# Altium project Design III.PrjPcb
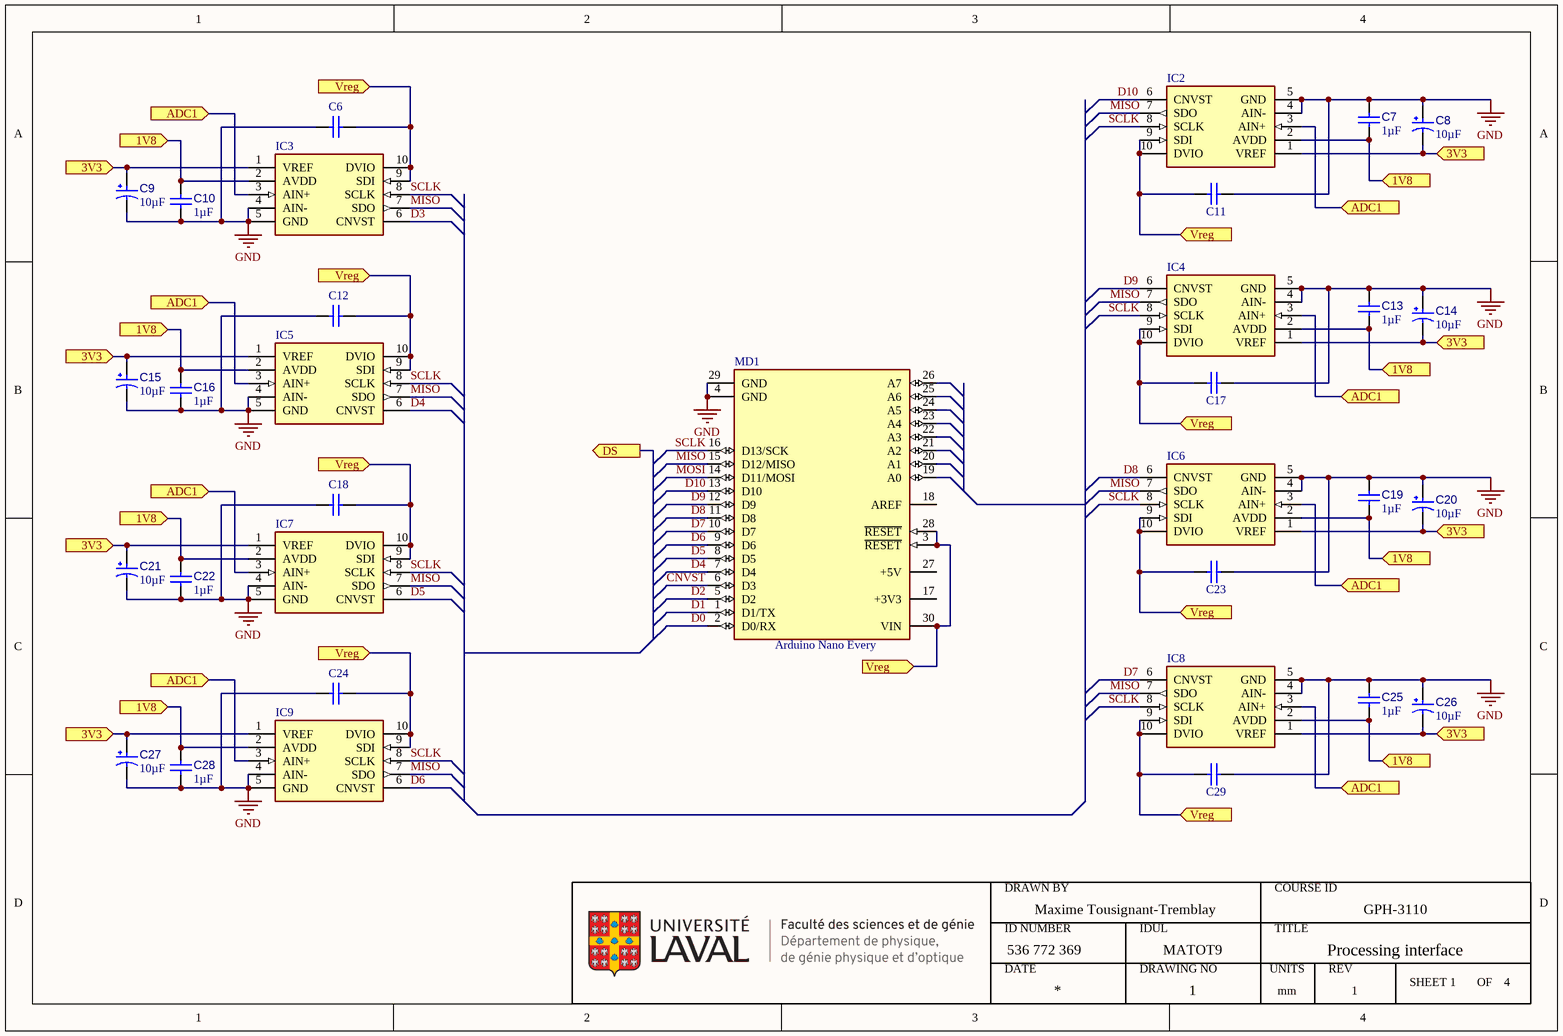
[diagram p0: Processing interface.SchDoc]
Author: =Author; CourseID: GPH-3110; DrawnBy: Maxime Tousignant-Tremblay; ID Number: 536 772 369; IDUL: MATOT9; Organization: =Organization; Revision: =Revision; SheetNumber: =SheetNumber; SheetTotal: =SheetTotal; Title: =Title; Units: mm
4 sheets, 127 parts. Net scope: flat (ports and power ports of the same name join across sheets).
Board file: PCB.PcbDoc
Sheets:
  Processing interface.SchDoc
  Thermistors.SchDoc
  Power Supply Unit.SchDoc
  Weatstone bridge.SchDoc

## Sheet Processing interface.SchDoc: Processing interface
size A4; Author: Maxime Tousignant-Tremblay; Revision: 1; SheetNumber: 1; SheetTotal: 4

### Parts
*4  ULaval FSG-DPGPO  (value not drawn)
C6  0402YC104KAT2A  [CAPC1005X56X25ML10T15]  (value not drawn)
C7  value 1µF  [CAPC0603(1608)100_L]  (hidden comment: Capacitor 1µF +/-0.1% 25V 0603)
C8  value 10µF  [CAPMP3217X18-T_V]  (hidden comment: TAJA106K016RNJ)
C9  value 10µF  [CAPMP3217X18-T_V]  (hidden comment: TAJA106K016RNJ)
C10  value 1µF  [CAPC0603(1608)100_L]  (hidden comment: Capacitor 1µF +/-0.1% 25V 0603)
C11  0402YC104KAT2A  [CAPC1005X56X25ML10T15]  (value not drawn)
C12  0402YC104KAT2A  [CAPC1005X56X25ML10T15]  (value not drawn)
C13  value 1µF  [CAPC0603(1608)100_L]  (hidden comment: Capacitor 1µF +/-0.1% 25V 0603)
C14  value 10µF  [CAPMP3217X18-T_V]  (hidden comment: TAJA106K016RNJ)
C15  value 10µF  [CAPMP3217X18-T_V]  (hidden comment: TAJA106K016RNJ)
C16  value 1µF  [CAPC0603(1608)100_L]  (hidden comment: Capacitor 1µF +/-0.1% 25V 0603)
C17  0402YC104KAT2A  [CAPC1005X56X25ML10T15]  (value not drawn)
C18  0402YC104KAT2A  [CAPC1005X56X25ML10T15]  (value not drawn)
C19  value 1µF  [CAPC0603(1608)100_L]  (hidden comment: Capacitor 1µF +/-0.1% 25V 0603)
C20  value 10µF  [CAPMP3217X18-T_V]  (hidden comment: TAJA106K016RNJ)
C21  value 10µF  [CAPMP3217X18-T_V]  (hidden comment: TAJA106K016RNJ)
C22  value 1µF  [CAPC0603(1608)100_L]  (hidden comment: Capacitor 1µF +/-0.1% 25V 0603)
C23  0402YC104KAT2A  [CAPC1005X56X25ML10T15]  (value not drawn)
C24  0402YC104KAT2A  [CAPC1005X56X25ML10T15]  (value not drawn)
C25  value 1µF  [CAPC0603(1608)100_L]  (hidden comment: Capacitor 1µF +/-0.1% 25V 0603)
C26  value 10µF  [CAPMP3217X18-T_V]  (hidden comment: TAJA106K016RNJ)
C27  value 10µF  [CAPMP3217X18-T_V]  (hidden comment: TAJA106K016RNJ)
C28  value 1µF  [CAPC0603(1608)100_L]  (hidden comment: Capacitor 1µF +/-0.1% 25V 0603)
C29  0402YC104KAT2A  [CAPC1005X56X25ML10T15]  (value not drawn)
IC2  MCP33141-10-E/MS  [New footprint 1]  (value not drawn)
IC3  MCP33141-10-E/MS  [New footprint 1]  (value not drawn)
IC4  MCP33141-10-E/MS  [New footprint 1]  (value not drawn)
IC5  MCP33141-10-E/MS  [New footprint 1]  (value not drawn)
IC6  MCP33141-10-E/MS  [New footprint 1]  (value not drawn)
IC7  MCP33141-10-E/MS  [New footprint 1]  (value not drawn)
IC8  MCP33141-10-E/MS  [New footprint 1]  (value not drawn)
IC9  MCP33141-10-E/MS  [New footprint 1]  (value not drawn)
MD1  Arduino Nano Every  [FP-A000005-MFG]

### Ports
1V8 (in, see Power Supply Unit[4C], Processing interface[1A], Processing interface[1B], Processing interface[1C], Processing interface[4A], Processing interface[4B], Processing interface[4C]), 1V8 (in, see Power Supply Unit[4C], Processing interface[1A], Processing interface[1B], Processing interface[1C], Processing interface[4A], Processing interface[4C]), 1V8 (in, see Power Supply Unit[4C], Processing interface[1A], Processing interface[1B], Processing interface[1C], Processing interface[4B], Processing interface[4C]), 1V8 (in, see Power Supply Unit[4C], Processing interface[1A], Processing interface[1C], Processing interface[4A], Processing interface[4B], Processing interface[4C]), 1V8 (in, see Power Supply Unit[4C], Processing interface[1B], Processing interface[1C], Processing interface[4A], Processing interface[4B], Processing interface[4C]), 3V3 (in, see Power Supply Unit[4B], Processing interface[1A], Processing interface[1B], Processing interface[1C], Processing interface[4A], Processing interface[4B], Processing interface[4C], Weatstone bridge[2B]), 3V3 (in, see Power Supply Unit[4B], Processing interface[1A], Processing interface[1B], Processing interface[1C], Processing interface[4A], Processing interface[4C], Weatstone bridge[2B]), 3V3 (in, see Power Supply Unit[4B], Processing interface[1A], Processing interface[1B], Processing interface[1C], Processing interface[4B], Processing interface[4C], Weatstone bridge[2B]), 3V3 (in, see Power Supply Unit[4B], Processing interface[1A], Processing interface[1C], Processing interface[4A], Processing interface[4B], Processing interface[4C], Weatstone bridge[2B]), 3V3 (in, see Power Supply Unit[4B], Processing interface[1B], Processing interface[1C], Processing interface[4A], Processing interface[4B], Processing interface[4C], Weatstone bridge[2B]), ADC1 (in, see Processing interface[1A], Processing interface[1B], Processing interface[1C], Processing interface[4A], Processing interface[4B], Processing interface[4C], Processing interface[4D], Weatstone bridge[4B]), ADC1 (in, see Processing interface[1A], Processing interface[1B], Processing interface[1C], Processing interface[4A], Processing interface[4B], Processing interface[4C], Weatstone bridge[4B]), ADC1 (in, see Processing interface[1A], Processing interface[1B], Processing interface[1C], Processing interface[4A], Processing interface[4B], Processing interface[4D], Weatstone bridge[4B]), ADC1 (in, see Processing interface[1A], Processing interface[1B], Processing interface[1C], Processing interface[4A], Processing interface[4C], Processing interface[4D], Weatstone bridge[4B]), ADC1 (in, see Processing interface[1A], Processing interface[1B], Processing interface[1C], Processing interface[4B], Processing interface[4C], Processing interface[4D], Weatstone bridge[4B]), ADC1 (in, see Processing interface[1A], Processing interface[1B], Processing interface[4A], Processing interface[4B], Processing interface[4C], Processing interface[4D], Weatstone bridge[4B]), ADC1 (in, see Processing interface[1B], Processing interface[1C], Processing interface[4A], Processing interface[4B], Processing interface[4C], Processing interface[4D], Weatstone bridge[4B]), DS (out, see Weatstone bridge[2B]), Vreg (in, see Power Supply Unit[3B], Processing interface[1A], Processing interface[1B], Processing interface[1C], Processing interface[3C], Processing interface[4A], Processing interface[4B], Processing interface[4C], Processing interface[4D], Weatstone bridge[2B], Weatstone bridge[2C], Weatstone bridge[3B]), Vreg (in, see Power Supply Unit[3B], Processing interface[1A], Processing interface[1B], Processing interface[1C], Processing interface[3C], Processing interface[4A], Processing interface[4B], Processing interface[4C], Weatstone bridge[2B], Weatstone bridge[2C], Weatstone bridge[3B]), Vreg (in, see Power Supply Unit[3B], Processing interface[1A], Processing interface[1B], Processing interface[1C], Processing interface[3C], Processing interface[4A], Processing interface[4B], Processing interface[4D], Weatstone bridge[2B], Weatstone bridge[2C], Weatstone bridge[3B]), Vreg (in, see Power Supply Unit[3B], Processing interface[1A], Processing interface[1B], Processing interface[1C], Processing interface[3C], Processing interface[4A], Processing interface[4C], Processing interface[4D], Weatstone bridge[2B], Weatstone bridge[2C], Weatstone bridge[3B]), Vreg (in, see Power Supply Unit[3B], Processing interface[1A], Processing interface[1B], Processing interface[1C], Processing interface[3C], Processing interface[4B], Processing interface[4C], Processing interface[4D], Weatstone bridge[2B], Weatstone bridge[2C], Weatstone bridge[3B]), Vreg (in, see Power Supply Unit[3B], Processing interface[1A], Processing interface[1B], Processing interface[1C], Processing interface[4A], Processing interface[4B], Processing interface[4C], Processing interface[4D], Weatstone bridge[2B], Weatstone bridge[2C], Weatstone bridge[3B]), Vreg (in, see Power Supply Unit[3B], Processing interface[1A], Processing interface[1B], Processing interface[3C], Processing interface[4A], Processing interface[4B], Processing interface[4C], Processing interface[4D], Weatstone bridge[2B], Weatstone bridge[2C], Weatstone bridge[3B]), Vreg (in, see Power Supply Unit[3B], Processing interface[1B], Processing interface[1C], Processing interface[3C], Processing interface[4A], Processing interface[4B], Processing interface[4C], Processing interface[4D], Weatstone bridge[2B], Weatstone bridge[2C], Weatstone bridge[3B])

### Nets
GND: C6.1 C7.2 C8.1 C9.2 C10.2 C11.1 C12.1 C13.2 C14.1 C15.2 C16.2 C17.1 C18.1 C19.2 C20.1 C21.2 C22.2 C23.1 C24.1 C25.2 C26.1 C27.2 C28.2 C29.1 IC2.4(AIN-) IC2.5(GND) IC3.4(AIN-) IC3.5(GND) IC4.4(AIN-) IC4.5(GND) IC5.4(AIN-) IC5.5(GND) IC6.4(AIN-) IC6.5(GND) IC7.4(AIN-) IC7.5(GND) IC8.4(AIN-) IC8.5(GND) IC9.4(AIN-) IC9.5(GND) MD1.4(GND) MD1.29(GND)
CNVST: MD1.6(D3)
D0: MD1.2(D0/RX)
D1: MD1.1(D1/TX)
D2: MD1.5(D2)
D3: IC3.6(CNVST)
D4: IC5.6(CNVST) MD1.7(D4)
D5: IC7.6(CNVST) MD1.8(D5)
D6: IC9.6(CNVST) MD1.9(D6)
D7: IC8.6(CNVST) MD1.10(D7)
D8: IC6.6(CNVST) MD1.11(D8)
D9: IC4.6(CNVST) MD1.12(D9)
D10: IC2.6(CNVST) MD1.13(D10)
MISO: IC2.7(SDO) IC3.7(SDO) IC4.7(SDO) IC5.7(SDO) IC6.7(SDO) IC7.7(SDO) IC8.7(SDO) IC9.7(SDO) MD1.15(D12/MISO)
MOSI: MD1.14(D11/MOSI)
SCLK: IC2.8(SCLK) IC3.8(SCLK) IC4.8(SCLK) IC5.8(SCLK) IC6.8(SCLK) IC7.8(SCLK) IC8.8(SCLK) IC9.8(SCLK) MD1.16(D13/SCK)
NetC1_1: C6.2 C11.2 C12.2 C17.2 C18.2 C23.2 C24.2 C29.2 IC2.9(SDI) IC2.10(DVIO) IC3.9(SDI) IC3.10(DVIO) IC4.9(SDI) IC4.10(DVIO) IC5.9(SDI) IC5.10(DVIO) IC6.9(SDI) IC6.10(DVIO) IC7.9(SDI) IC7.10(DVIO) IC8.9(SDI) IC8.10(DVIO) IC9.9(SDI) IC9.10(DVIO) MD1.3(~{RESET}) MD1.28(~{RESET}) MD1.30(VIN) ; port Vreg
NetC7_1: C7.1 C10.1 C13.1 C16.1 C19.1 C22.1 C25.1 C28.1 IC2.2(AVDD) IC3.2(AVDD) IC4.2(AVDD) IC5.2(AVDD) IC6.2(AVDD) IC7.2(AVDD) IC8.2(AVDD) IC9.2(AVDD) ; port 1V8
NetC8_2: C8.2 C9.1 C14.2 C15.1 C20.2 C21.1 C26.2 C27.1 IC2.1(VREF) IC3.1(VREF) IC4.1(VREF) IC5.1(VREF) IC6.1(VREF) IC7.1(VREF) IC8.1(VREF) IC9.1(VREF) ; port 3V3
NetIC2_3: IC2.3(AIN+) IC3.3(AIN+) IC4.3(AIN+) IC5.3(AIN+) IC6.3(AIN+) IC7.3(AIN+) IC8.3(AIN+) IC9.3(AIN+) ; port ADC1

Not connected (* = marked no-connect by the designer): MD1 17(+3V3) 18(AREF) 19(A0) 20(A1) 21(A2) 22(A3) 23(A4) 24(A5) 25(A6) 26(A7) 27(+5V)

### Notes on the sheet
- (in symbol ULaval FSG-DPGPO) DRAWN BY; COURSE ID; ID NUMBER; IDUL; TITLE; DATE; DRAWING NO; UNITS; REV; SHEET; OF

### Library data of the parts
C6 C11 C12 C17 C18 C23 C24 C29 = CMP-2008-02800-1: Manufacturer: AVX Interconnect / Elco; Part Number: 0402YC104KAT2A
C7 C10 C13 C16 C19 C22 C25 C28 = CMP-001-00055-4: Chip Capacitor, 1µF +/-0.1%, 25V, 0603, Thickness 1 mm; Tolerance: 20%; Min Operating Temperature: -55°C; Max Operating Temperature: 85°C; Voltage Rating: 25V; Mounting Technology: SMT; Case/Package: 0603; Pins: 2
C8 C9 C14 C15 C20 C21 C26 C27 = CMP-001-00041-7: Standard Tantalum, 10 uF, +/- 10%, 16 V, -55 to 125 degC, 1206 (3216 Metric), RoHS, Tape and Reel; Manufacturer: AVX; Voltage Rating: 16V; ESR: 3Ohm; Datasheet URL: http://datasheets.avx.com/TAJ.pdf; Package URL: http://www.avx.com/download/software/literature/AVX-Footprint-Library.pdf; Pins: 2; Package Reference: CAPMP3217X18-T; RoHS Compliant: True; Case/Package: 1206; Max Operating Temperature: 125°C; Package Description: 2-Pin Surface Mount Device, Body 3.2 x 1.65 mm; Mounting Technology: SM; Tolerance: 10%; Package Quantity: 1; Packaging: TapeandReel; Min Operating Temperature: -55°C; Datasheet Version: Feb-16; Manufacturer URL: http://www.avx.com/; Capacitor Type: Tantalum
IC2-IC9 = CMP-020-00028-2: ADC Single SAR 1Msps 12-bit Serial Microwire/SPI 10-Pin MSOP Tray
MD1 = CMP-189986-000002-1: ARDUINO NANO ATMEGA328 EVAL BRD; Number of Bits: 8; Evaluation Kit: Yes; Operating Supply Voltage: 12V; Interface: I2C; Data Bus Width: 8b; Core Architecture: AVR; Packaging: Bulk; Length: 7inch; Package Quantity: 50; Width: 5inch; REACH SVHC: No SVHC; Weight: 0.358383oz; Series: AVR® ATmega; Height: 0.25inch

## Sheet Thermistors.SchDoc: Thermistors array
size A4; Revision: 1; SheetNumber: 2; SheetTotal: 4
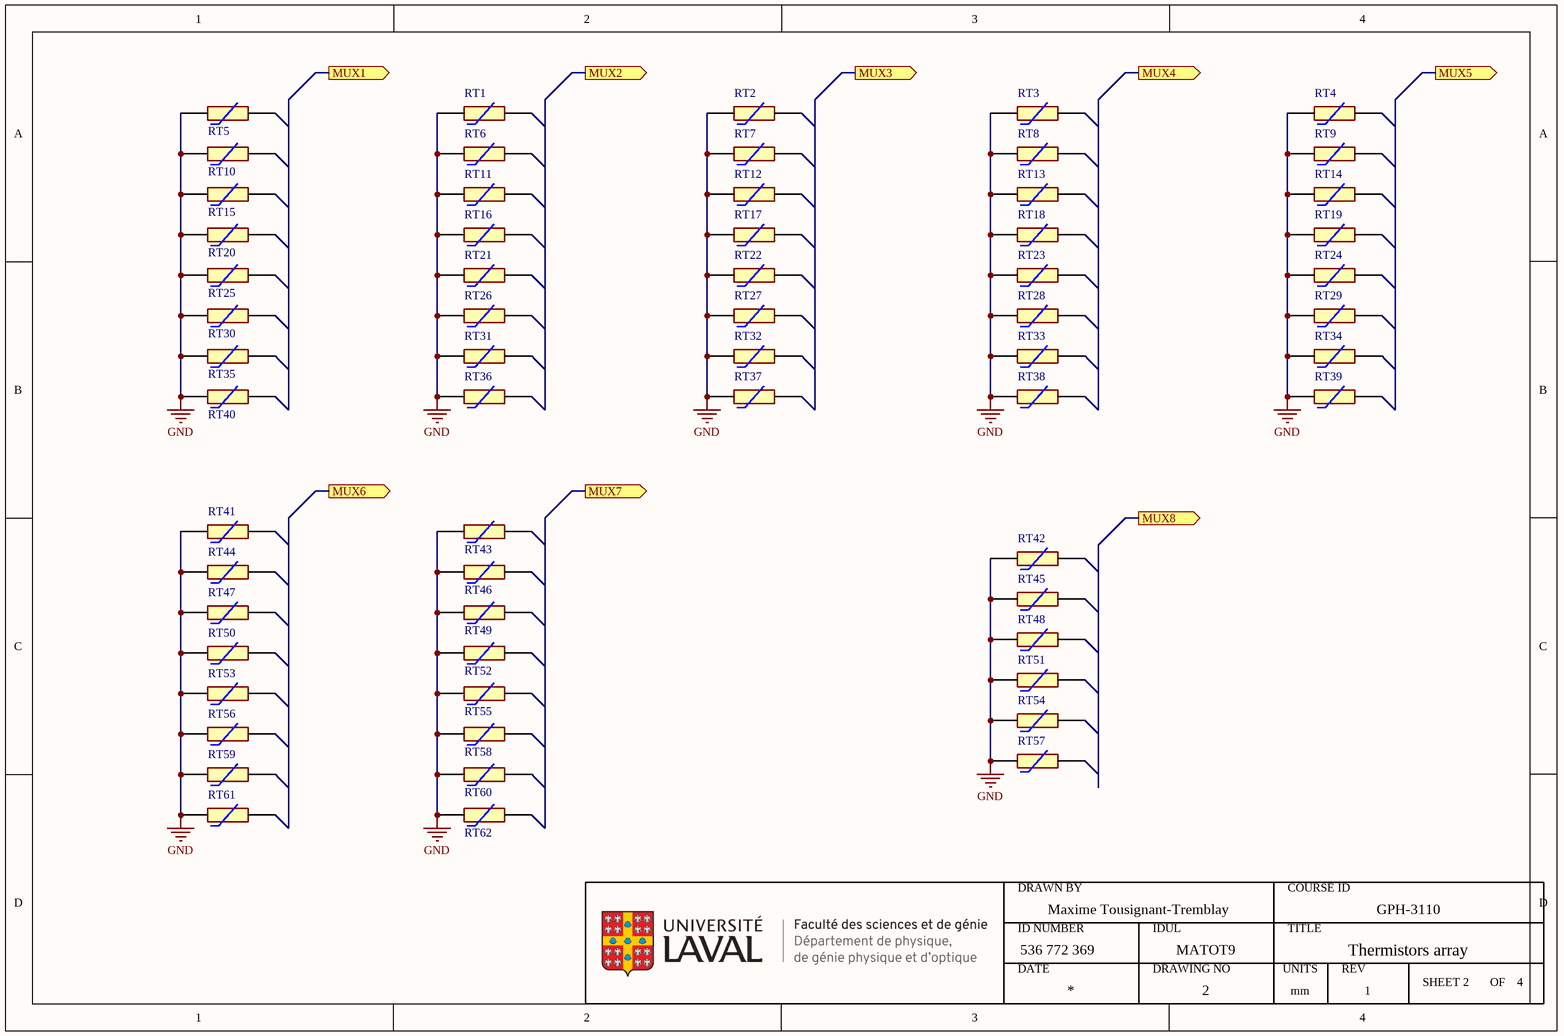
[diagram p1: Thermistors.SchDoc]

### Parts
*2  ULaval FSG-DPGPO  (value not drawn)
RT1  NTCLE350E4103FHB0  [NTCLE350E4103FHB0]  (value not drawn)
RT2  NTCLE350E4103FHB0  [NTCLE350E4103FHB0]  (value not drawn)
RT3  NTCLE350E4103FHB0  [NTCLE350E4103FHB0]  (value not drawn)
RT4  NTCLE350E4103FHB0  [NTCLE350E4103FHB0]  (value not drawn)
RT5  NTCLE350E4103FHB0  [NTCLE350E4103FHB0]  (value not drawn)
RT6  NTCLE350E4103FHB0  [NTCLE350E4103FHB0]  (value not drawn)
RT7  NTCLE350E4103FHB0  [NTCLE350E4103FHB0]  (value not drawn)
RT8  NTCLE350E4103FHB0  [NTCLE350E4103FHB0]  (value not drawn)
RT9  NTCLE350E4103FHB0  [NTCLE350E4103FHB0]  (value not drawn)
RT10  NTCLE350E4103FHB0  [NTCLE350E4103FHB0]  (value not drawn)
RT11  NTCLE350E4103FHB0  [NTCLE350E4103FHB0]  (value not drawn)
RT12  NTCLE350E4103FHB0  [NTCLE350E4103FHB0]  (value not drawn)
RT13  NTCLE350E4103FHB0  [NTCLE350E4103FHB0]  (value not drawn)
RT14  NTCLE350E4103FHB0  [NTCLE350E4103FHB0]  (value not drawn)
RT15  NTCLE350E4103FHB0  [NTCLE350E4103FHB0]  (value not drawn)
RT16  NTCLE350E4103FHB0  [NTCLE350E4103FHB0]  (value not drawn)
RT17  NTCLE350E4103FHB0  [NTCLE350E4103FHB0]  (value not drawn)
RT18  NTCLE350E4103FHB0  [NTCLE350E4103FHB0]  (value not drawn)
RT19  NTCLE350E4103FHB0  [NTCLE350E4103FHB0]  (value not drawn)
RT20  NTCLE350E4103FHB0  [NTCLE350E4103FHB0]  (value not drawn)
RT21  NTCLE350E4103FHB0  [NTCLE350E4103FHB0]  (value not drawn)
RT22  NTCLE350E4103FHB0  [NTCLE350E4103FHB0]  (value not drawn)
RT23  NTCLE350E4103FHB0  [NTCLE350E4103FHB0]  (value not drawn)
RT24  NTCLE350E4103FHB0  [NTCLE350E4103FHB0]  (value not drawn)
RT25  NTCLE350E4103FHB0  [NTCLE350E4103FHB0]  (value not drawn)
RT26  NTCLE350E4103FHB0  [NTCLE350E4103FHB0]  (value not drawn)
RT27  NTCLE350E4103FHB0  [NTCLE350E4103FHB0]  (value not drawn)
RT28  NTCLE350E4103FHB0  [NTCLE350E4103FHB0]  (value not drawn)
RT29  NTCLE350E4103FHB0  [NTCLE350E4103FHB0]  (value not drawn)
RT30  NTCLE350E4103FHB0  [NTCLE350E4103FHB0]  (value not drawn)
RT31  NTCLE350E4103FHB0  [NTCLE350E4103FHB0]  (value not drawn)
RT32  NTCLE350E4103FHB0  [NTCLE350E4103FHB0]  (value not drawn)
RT33  NTCLE350E4103FHB0  [NTCLE350E4103FHB0]  (value not drawn)
RT34  NTCLE350E4103FHB0  [NTCLE350E4103FHB0]  (value not drawn)
RT35  NTCLE350E4103FHB0  [NTCLE350E4103FHB0]  (value not drawn)
RT36  NTCLE350E4103FHB0  [NTCLE350E4103FHB0]  (value not drawn)
RT37  NTCLE350E4103FHB0  [NTCLE350E4103FHB0]  (value not drawn)
RT38  NTCLE350E4103FHB0  [NTCLE350E4103FHB0]  (value not drawn)
RT39  NTCLE350E4103FHB0  [NTCLE350E4103FHB0]  (value not drawn)
RT40  NTCLE350E4103FHB0  [NTCLE350E4103FHB0]  (value not drawn)
RT41  NTCLE350E4103FHB0  [NTCLE350E4103FHB0]  (value not drawn)
RT42  NTCLE350E4103FHB0  [NTCLE350E4103FHB0]  (value not drawn)
RT43  NTCLE350E4103FHB0  [NTCLE350E4103FHB0]  (value not drawn)
RT44  NTCLE350E4103FHB0  [NTCLE350E4103FHB0]  (value not drawn)
RT45  NTCLE350E4103FHB0  [NTCLE350E4103FHB0]  (value not drawn)
RT46  NTCLE350E4103FHB0  [NTCLE350E4103FHB0]  (value not drawn)
RT47  NTCLE350E4103FHB0  [NTCLE350E4103FHB0]  (value not drawn)
RT48  NTCLE350E4103FHB0  [NTCLE350E4103FHB0]  (value not drawn)
RT49  NTCLE350E4103FHB0  [NTCLE350E4103FHB0]  (value not drawn)
RT50  NTCLE350E4103FHB0  [NTCLE350E4103FHB0]  (value not drawn)
RT51  NTCLE350E4103FHB0  [NTCLE350E4103FHB0]  (value not drawn)
RT52  NTCLE350E4103FHB0  [NTCLE350E4103FHB0]  (value not drawn)
RT53  NTCLE350E4103FHB0  [NTCLE350E4103FHB0]  (value not drawn)
RT54  NTCLE350E4103FHB0  [NTCLE350E4103FHB0]  (value not drawn)
RT55  NTCLE350E4103FHB0  [NTCLE350E4103FHB0]  (value not drawn)
RT56  NTCLE350E4103FHB0  [NTCLE350E4103FHB0]  (value not drawn)
RT57  NTCLE350E4103FHB0  [NTCLE350E4103FHB0]  (value not drawn)
RT58  NTCLE350E4103FHB0  [NTCLE350E4103FHB0]  (value not drawn)
RT59  NTCLE350E4103FHB0  [NTCLE350E4103FHB0]  (value not drawn)
RT60  NTCLE350E4103FHB0  [NTCLE350E4103FHB0]  (value not drawn)
RT61  NTCLE350E4103FHB0  [NTCLE350E4103FHB0]  (value not drawn)
RT62  NTCLE350E4103FHB0  [NTCLE350E4103FHB0]  (value not drawn)

### Ports
MUX1 (out), MUX2 (out), MUX3 (out), MUX4 (out), MUX5 (out), MUX6 (out), MUX7 (out), MUX8 (out)

### Nets
GND: RT1.1 RT2.1 RT3.1 RT4.1 RT5.1 RT6.1 RT7.1 RT8.1 RT9.1 RT10.1 RT11.1 RT12.1 RT13.1 RT14.1 RT15.1 RT16.1 RT17.1 RT18.1 RT19.1 RT20.1 RT21.1 RT22.1 RT23.1 RT24.1 RT25.1 RT26.1 RT27.1 RT28.1 RT29.1 RT30.1 RT31.1 RT32.1 RT33.1 RT34.1 RT35.1 RT36.1 RT37.1 RT38.1 RT39.1 RT40.1 RT41.1 RT42.1 RT43.1 RT44.1 RT45.1 RT46.1 RT47.1 RT48.1 RT49.1 RT50.1 RT51.1 RT52.1 RT53.1 RT54.1 RT55.1 RT56.1 RT57.1 RT58.1 RT59.1 RT60.1 RT61.1 RT62.1

Not connected (* = marked no-connect by the designer): RT1 2; RT2 2; RT3 2; RT4 2; RT5 2; RT6 2; RT7 2; RT8 2; RT9 2; RT10 2; RT11 2; RT12 2; RT13 2; RT14 2; RT15 2; RT16 2; RT17 2; RT18 2; RT19 2; RT20 2; RT21 2; RT22 2; RT23 2; RT24 2; RT25 2; RT26 2; RT27 2; RT28 2; RT29 2; RT30 2; RT31 2; RT32 2; RT33 2; RT34 2; RT35 2; RT36 2; RT37 2; RT38 2; RT39 2; RT40 2; RT41 2; RT42 2; RT43 2; RT44 2; RT45 2; RT46 2; RT47 2; RT48 2; RT49 2; RT50 2; RT51 2; RT52 2; RT53 2; RT54 2; RT55 2; RT56 2; RT57 2; RT58 2; RT59 2; RT60 2; RT61 2; RT62 2

### Notes on the sheet
- (in symbol ULaval FSG-DPGPO) DRAWN BY; COURSE ID; ID NUMBER; IDUL; TITLE; DATE; DRAWING NO; UNITS; REV; SHEET; OF

### Library data of the parts
RT1-RT62 = NTCLE350E4103FHB0: Thermistor; Manufacturer_Name: Vishay; Datasheet Link: https://www.vishay.com/docs/29218/ntcle350e4.pdf; Height: 7mm; Manufacturer_Part_Number: NTCLE350E4103FHB0

## Sheet Power Supply Unit.SchDoc: Power Supply Unit
size A4; DrawnBy: Maxime Tousignant-Tremblay; DocumentNumber: GPH-3110-1; Revision: 1; SheetNumber: 3; SheetTotal: 4; SPICEModelCacheSEIOAEZJ: <root> / <DocumentId>SEIOAEZJ</DocumentId> / </root>
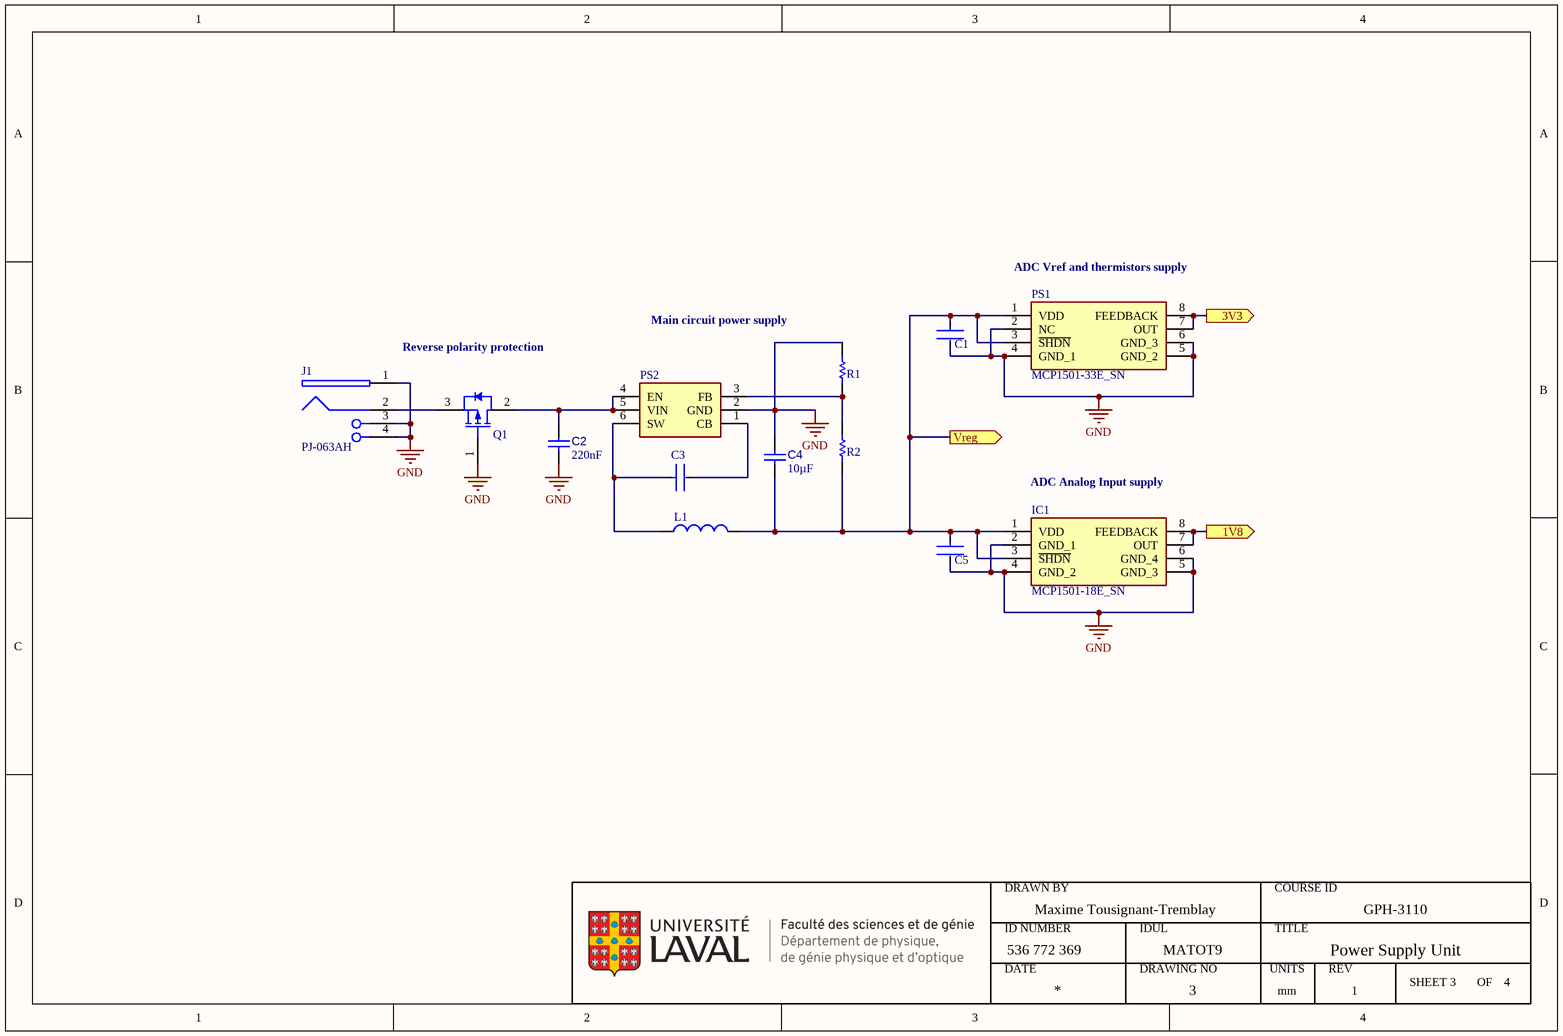
[diagram p2: Power Supply Unit.SchDoc]

### Parts
*1  ULaval FSG-DPGPO  (value not drawn)
C1  CL10A225KO8NNNC  [FP-CL10-IPC_A]  (value not drawn)
C2  value 220nF  [CAPC0402(1005)60_L]  (hidden comment: Capacitor 220nF +/-20% 10V 0402)
C3  CC0603KRX7R9BB104  [FP-CC0603-DA-MFG]  (value not drawn)
C4  value 10µF  [CAPC2013X135X45NL10T25]  (hidden comment: Capacitor 10 uF +/- 10% 16 V 0805)
C5  CL10A225KO8NNNC  [FP-CL10-IPC_A]  (value not drawn)
IC1  MCP1501-18E_SN  [SOIC127P600X175-8N]
J1  PJ-063AH  [CUI-PJ-063AH_V]
L1  7447916  [SMD-1210]  (value not drawn)
PS1  MCP1501-33E_SN  [SOIC127P600X175-8N]
PS2  LMR50410YFQDBVRQ1  [SOT95P280X145-6N]  (value not drawn)
Q1  IPD90P03P4-04  [INF-PG-TO252-3-11_N]  (value not drawn)
R1  RC0402FR-1322K1L  [RESC1005X40X25ML05T10]  (value not drawn)
R2  RC0402FR-0788K7L  [RESC1005X40X25NL05T10]  (value not drawn)

### Ports
1V8 (out, see Processing interface[1A], Processing interface[1B], Processing interface[1C], Processing interface[4A], Processing interface[4B], Processing interface[4C]), 3V3 (out, see Processing interface[1A], Processing interface[1B], Processing interface[1C], Processing interface[4A], Processing interface[4B], Processing interface[4C], Weatstone bridge[2B]), Vreg (out, see Processing interface[1A], Processing interface[1B], Processing interface[1C], Processing interface[3C], Processing interface[4A], Processing interface[4B], Processing interface[4C], Processing interface[4D], Weatstone bridge[2B], Weatstone bridge[2C], Weatstone bridge[3B])

### Nets
GND: C1.2 C2.2 C4.2 C5.2 IC1.2(GND_1) IC1.4(GND_2) IC1.5(GND_3) IC1.6(GND_4) J1.1 J1.3(SHLD) J1.4(SHLD) PS1.2(NC) PS1.4(GND_1) PS1.5(GND_2) PS1.6(GND_3) PS2.2(GND) Q1.1(GATE) R1.2
NetC1_1: C1.1 C4.1 C5.1 IC1.1(VDD) IC1.3(~{SHDN}) L1.2 PS1.1(VDD) PS1.3(~{SHDN}) R2.1 ; port Vreg
NetC2_1: C2.1 PS2.4(EN) PS2.5(VIN) Q1.2(DRAIN)
NetC3_1: C3.1 L1.1 PS2.6(SW)
NetC3_2: C3.2 PS2.1(CB)
NetC7_1: IC1.7(OUT) IC1.8(FEEDBACK) ; port 1V8
NetC8_2: PS1.7(OUT) PS1.8(FEEDBACK) ; port 3V3
NetJ1_2: J1.2 Q1.3(SOURCE)
NetPS2_3: PS2.3(FB) R1.1 R2.2

### Notes on the sheet
- (near PS1) ADC Vref and thermistors supply
- Reverse polarity protection
- Main circuit power supply
- (near IC1) ADC Analog Input supply
- (in symbol ULaval FSG-DPGPO) DRAWN BY; COURSE ID; ID NUMBER; IDUL; TITLE; DATE; DRAWING NO; UNITS; REV; SHEET; OF

### Library data of the parts
C1 C5 = CMP-13271-000835-1: Cap Ceramic 2.2uF 16V X5R ±10% Pad SMD 0603 +85°C T/R; Case Code (Metric): 1608; Height: 0.8mm; Case/Package: 0603; Depth: 0.8mm; Capacitance: 2.2uF; Voltage Rating: 16V; Case Code (Imperial): 0603; Length: 1.6mm; Packaging: Tape and Reel; Material: Ceramic; Lead Free: Lead Free; Max Operating Temperature: 85°C; Contact Plating: Tin; Thickness: 0.035inch; Radiation Hardening: No; Tolerance: 10%; Min Operating Temperature: -55°C; Voltage: 16V; Dielectric: X5R; Mount: Surface Mount; Package Quantity: 4000; Width: 0.031inch; Voltage Rating (DC): 16V
C2 = CMP-001-00057-3: Chip Capacitor, 220nF +/-20%, 10V, 0402, Thickness 0.6 mm; Tolerance: 10%; Max Operating Temperature: 85°C; Pins: 2; Case/Package: 0402; Mounting Technology: SMT; Voltage Rating: 10V; Min Operating Temperature: -55°C
C3 = CMP-2100-03601-2: CAP CER 0.1UF 50V X7R 0603; Manufacturer: YAGEO; Material: Ceramic; Capacitance: 100 nF; Temperature Coefficient: 15%; Tolerance: 0.1; Value: 100 nF; Description: CC0603 100 nF X7R 10.00% 50 V; Height: 0.9mm; Voltage: 50 V; ComponentLink2Description: Datasheet; Device Class L2: Capacitors; Temperature Range High: +125°C; Category: Cap; Footprint Url: http://www.yageo.com/exep/pages/download/literatures/UPY-C_GEN_24.pdf; ComponentLink2URL: http://www.yageo.com/documents/recent/UPY-GPHC_X7R_6.3V-to-50V_18.pdf; Package: CC0603-DA; Temperature: -55°C to +125°C; Voltage Rating: 50 V; Temperature Characteristic: X7R; Device Class L1: Passive Components; Temperature Range Low: -55°C; Manufacturer Part Number: CC0603KRX7R9BB104; RoHS: TRUE; Automotive: No; Device Class L3: Ceramic Capacitors; Octopart: https://octopart.com/cc0603krx7r9bb104-yageo-42244635; Mouser Description: Multilayer Ceramic Capacitor, CC Series, 0.1 - F, - 10%, X7R, 50 V, 0603 [1608 Metric]; Lead Free: Yes; Digikey Description: CAP CER 0.1UF 50V X7R 0603
C4 = CMP-001-00015-6: Chip Capacitor, 10 uF, +/- 10%, 16 V, 0805 (2012 Metric); Voltage Rating: 16V; Capacitor Type: Ceramic; RoHS Compliant: True; Max Operating Temperature: 85°C; Min Operating Temperature: -55°C; Mounting Technology: SM; Tolerance: 10%; Case/Package: 0805; Pins: 2
IC1 = MCP1501-18E_SN: Integrated Circuit; Manufacturer_Name: Microchip; Manufacturer_Part_Number: MCP1501-18E/SN; Datasheet Link: http://ww1.microchip.com/downloads/en/DeviceDoc/20005474E.pdf; Height: 1.75mm; Mouser Part Number: 579-MCP1501-18E/SN; Mouser Price/Stock: https://www.mouser.co.uk/ProductDetail/Microchip-Technology-Atmel/MCP1501-18E-SN?qs=BA62vJVifGrqbCLW75KQyA%3D%3D; Arrow Part Number: MCP1501-18E/SN; Arrow Price/Stock: https://www.arrow.com/en/products/mcp1501-18esn/microchip-technology?region=nac
J1 = CMP-2000-06898-1: Through Hole Right Angle DC Power Jack, 8 A, 2 mm Center Pin, 2 Position, -25 to 85 degC, RoHS, Bulk; Manufacturer: CUIInc.; Voltage Rating: 24V; Current Rating: 8A; Inside Contact Diameter: 2mm; Insulation Resistance: 100MOhms; Outside Contact Diameter: 6.5mm; Brand: CUI; Termination Style: ThroughHole; Flammability Rating: UL94V-0; Datasheet Version: Rev. 1.02, 03/2016; Manufacturer URL: http://www.cui.com/; Product Category: DCPowerConnectors; Package Description: 2-Pin Through Hole Device, Body 13 x 10 mm, Height 9 mm; Connector Type: DCPowerJack; Factory Pack Quantity: 500; Contact Plating: Nickel; Mounting Style: KinkedPin; Contact Material: Copper; RoHS: True; Mounting Angle: Right; Package Reference: PJ-063AH; Product: Jacks; Contact Gender: Male; Datasheet URL: http://www.cui.com/product/resource/pj-063ah.pdf; Housing Material: PolybutyleneTerephthalate(PBT); Mounting Technology: ThroughHole; Operating Temperature Range: -25Cto+85C
L1 = CMP-0221-00031-1: SMD-Multilayer Inductor WE-MI, L = 4.70 µH; Inductance: 4.70 ÂµH; ComponentLink2Description: Datasheet; PackageReference: SMD-1210; ComponentLink1Description: Manufacturer Link; PackageDescription: Chip Inductor, 2-Leads, Body 3.2 x 2.5 mm; PackageVersion: 2007; ComponentLink1URL: http://www.we-online.com; DatasheetVersion: ver 5, Oct-2004; ComponentLink2URL: http://www.we-online.de/katalog/media/pdf/7447916.pdf
PS1 = MCP1501-33E_SN: Power Supply; Manufacturer_Name: Microchip; Manufacturer_Part_Number: MCP1501-33E/SN; Datasheet Link: http://www.farnell.com/datasheets/2158574.pdf; Height: 1.75mm; Mouser Part Number: 579-MCP1501-33E/SN; Mouser Price/Stock: https://www.mouser.co.uk/ProductDetail/Microchip-Technology-Atmel/MCP1501-33E-SN?qs=BA62vJVifGoOZffNI8tq9A%3D%3D; Arrow Part Number: MCP1501-33E/SN; Arrow Price/Stock: https://www.arrow.com/en/products/mcp1501-33esn/microchip-technology?region=nac
PS2 = LMR50410YFQDBVRQ1: Power Supply; Manufacturer_Name: Texas Instruments; Datasheet Link: https://www.ti.com/product/LMR50410-Q1; Height: 1.45mm; Manufacturer_Part_Number: LMR50410YFQDBVRQ1; Mouser Part Number: 595-MR50410YFQDBVRQ1; Mouser Price/Stock: https://www.mouser.co.uk/ProductDetail/Texas-Instruments/LMR50410YFQDBVRQ1?qs=81r%252BiQLm7BRUAgUFqYZycA%3D%3D; Arrow Part Number: LMR50410YFQDBVRQ1; Arrow Price/Stock: https://www.arrow.com/en/products/lmr50410yfqdbvrq1/texas-instruments?region=nac
Q1 = CMP-013-00034-1: Single P-Channel 30 V 4.5 mOhm 100 nC OptiMOS Power Mosfet - TO-252-3-11; Gate to Source Voltage (Vgs): 20V; Input Capacitance: 10.3nF; Rds On Max: 4.5mR; Drain to Source Breakdown Voltage: 30V; Power Dissipation: 137W; Max Dual Supply Voltage: -30V; Continuous Drain Current (ID): 90A; Turn-Off Delay Time: 70ns; Halogen Free: Halogen Free; Min Operating Temperature: -55°C; RoHS Compliant: Yes; Max Operating Temperature: 175°C; Pins: 3; Lead Free: Lead Free; Packaging: Tape and Reel; Package Quantity: 1; Reach SVHC Compliant: Yes; Drain to Source Voltage (Vdss): -30V; Max Power Dissipation: 137W; Element Configuration: Single; Drain to Source Resistance: 4.5mR; Series: OptiMOS™; Case/Package: TO-252-3
R1 = CMP-2002-07868-1: Manufacturer: Yageo / Phycomp; Part Number: RC0402FR-1322K1L
R2 = CMP-2002-07828-1: Manufacturer: Yageo; Part Number: RC0402FR-0788K7L

## Sheet Weatstone bridge.SchDoc: Weatstone bridge
size A4; Revision: 1; SheetNumber: 4; SheetTotal: 4
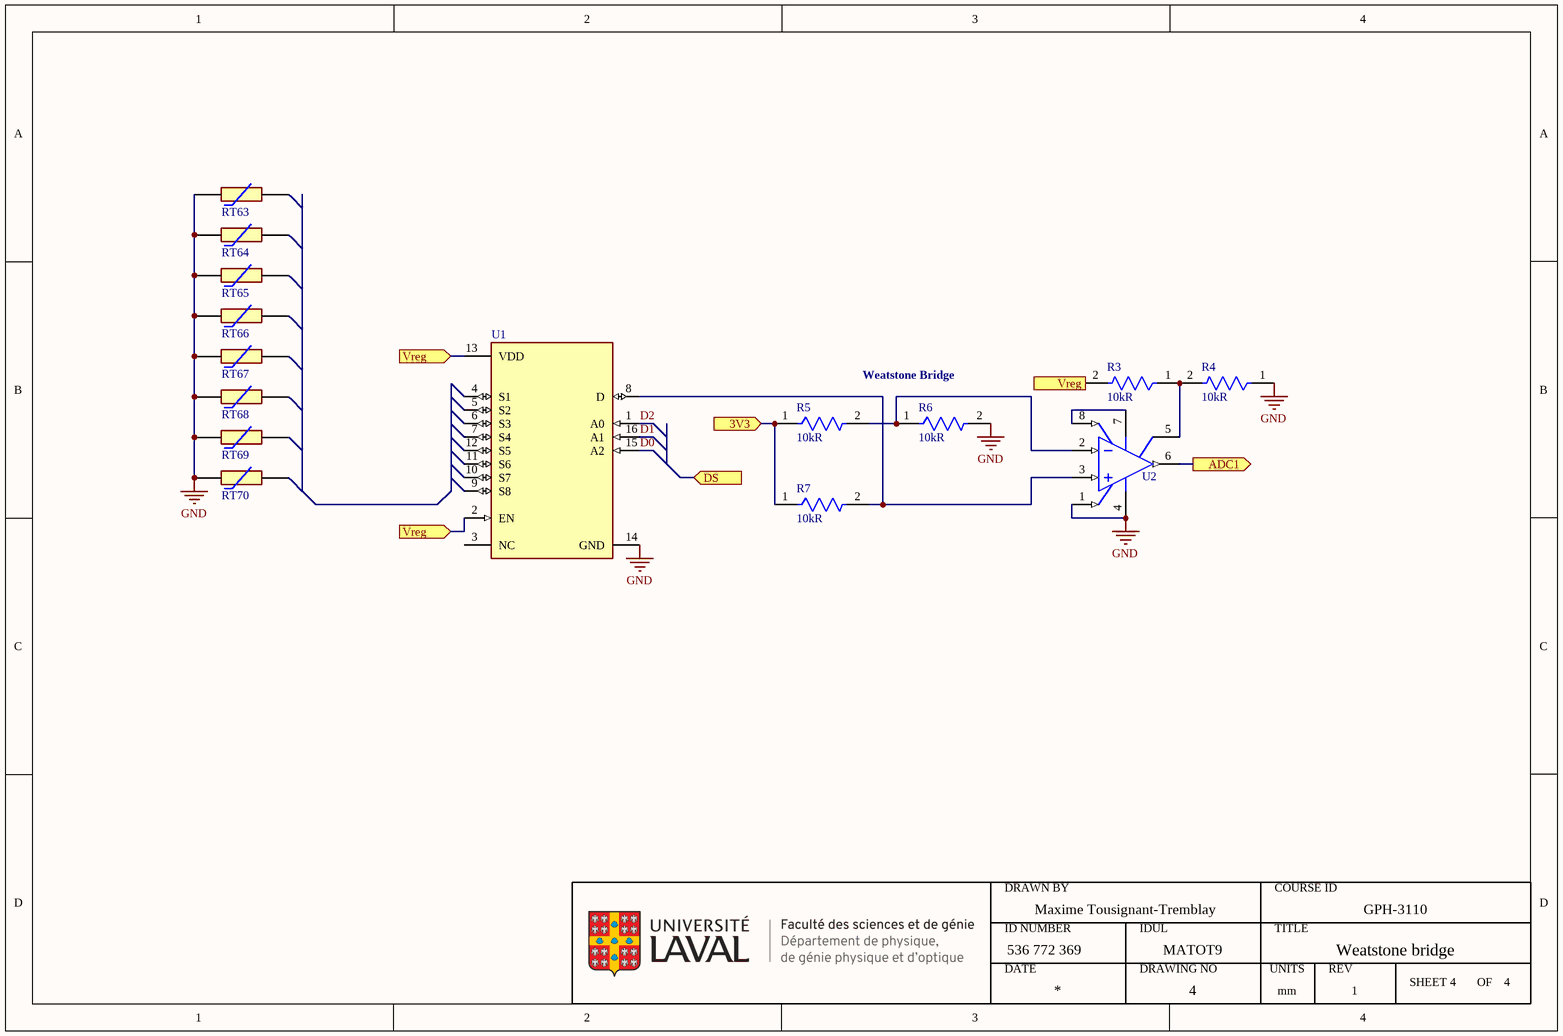
[diagram p3: Weatstone bridge.SchDoc]

### Parts
*3  ULaval FSG-DPGPO  (value not drawn)
R3  value 10kR  [FP-RT0603-IPC_C]  (hidden comment: RT0603BRD0710KL)
R4  value 10kR  [FP-RT0603-IPC_C]  (hidden comment: RT0603BRD0710KL)
R5  value 10kR  [FP-RT0603-IPC_C]  (hidden comment: RT0603BRD0710KL)
R6  value 10kR  [FP-RT0603-IPC_C]  (hidden comment: RT0603BRD0710KL)
R7  value 10kR  [FP-RT0603-IPC_C]  (hidden comment: RT0603BRD0710KL)
RT63  NTCLE350E4103FHB0  [NTCLE350E4103FHB0]  (value not drawn)
RT64  NTCLE350E4103FHB0  [NTCLE350E4103FHB0]  (value not drawn)
RT65  NTCLE350E4103FHB0  [NTCLE350E4103FHB0]  (value not drawn)
RT66  NTCLE350E4103FHB0  [NTCLE350E4103FHB0]  (value not drawn)
RT67  NTCLE350E4103FHB0  [NTCLE350E4103FHB0]  (value not drawn)
RT68  NTCLE350E4103FHB0  [NTCLE350E4103FHB0]  (value not drawn)
RT69  NTCLE350E4103FHB0  [NTCLE350E4103FHB0]  (value not drawn)
RT70  NTCLE350E4103FHB0  [NTCLE350E4103FHB0]  (value not drawn)
U1  TMUX1208PWR  [FP-PW0016A-IPC_B]  (value not drawn)
U2  MCP6N11-100E/SN  [SOIC-SN8_L]  (value not drawn)

### Ports
3V3 (in, see Power Supply Unit[4B], Processing interface[1A], Processing interface[1B], Processing interface[1C], Processing interface[4A], Processing interface[4B], Processing interface[4C]), ADC1 (out, see Processing interface[1A], Processing interface[1B], Processing interface[1C], Processing interface[4A], Processing interface[4B], Processing interface[4C], Processing interface[4D]), DS (in, see Processing interface[2B]), Vreg (in, see Power Supply Unit[3B], Processing interface[1A], Processing interface[1B], Processing interface[1C], Processing interface[3C], Processing interface[4A], Processing interface[4B], Processing interface[4C], Processing interface[4D], Weatstone bridge[2B], Weatstone bridge[2C]), Vreg (in, see Power Supply Unit[3B], Processing interface[1A], Processing interface[1B], Processing interface[1C], Processing interface[3C], Processing interface[4A], Processing interface[4B], Processing interface[4C], Processing interface[4D], Weatstone bridge[2B], Weatstone bridge[3B]), Vreg (in, see Power Supply Unit[3B], Processing interface[1A], Processing interface[1B], Processing interface[1C], Processing interface[3C], Processing interface[4A], Processing interface[4B], Processing interface[4C], Processing interface[4D], Weatstone bridge[2C], Weatstone bridge[3B])

### Nets
GND: R4.1 R6.2 RT63.1 RT64.1 RT65.1 RT66.1 RT67.1 RT68.1 RT69.1 RT70.1 U1.14(GND) U2.1(VFG) U2.4(VSS)
D0: U1.15(A2)
D1: U1.16(A1)
D2: U1.1(A0)
NetC1_1: R3.2 U1.2(EN) U1.13(VDD) ; port Vreg
NetC8_2: R5.1 R7.1 ; port 3V3
NetIC2_3: U2.6(VOUT) ; port ADC1
NetR3_1: R3.1 R4.2 U2.5(VREF)
NetR5_2: R5.2 R6.1 U2.2(VIM)
NetR7_2: R7.2 U1.8(D) U2.3(VIP)
NetU2_7: U2.7(VDD) U2.8(EN/~{CAL})

Not connected (* = marked no-connect by the designer): RT63 2; RT64 2; RT65 2; RT66 2; RT67 2; RT68 2; RT69 2; RT70 2; U1 3(NC) 4(S1) 5(S2) 6(S3) 7(S4) 9(S8) 10(S7) 11(S6) 12(S5)

### Notes on the sheet
- Weatstone Bridge
- (in symbol ULaval FSG-DPGPO) DRAWN BY; COURSE ID; ID NUMBER; IDUL; TITLE; DATE; DRAWING NO; UNITS; REV; SHEET; OF

### Library data of the parts
R3-R7 = CMP-009-00178-1: Res High precision Thin Film 0603 10K Ohm 0.1% 1/10W ±25ppm/°C Molded SMD Paper T/R; Max Power Dissipation: 100mW; Working Voltage: 75V; RoHS Compliant: Yes; Power Rating: 100mW; Lead Free: Lead Free; Depth: 0.8mm; Case Code (Imperial): 0603; Max Operating Temperature: 155°C; Voltage Rating: 75V; Package Quantity: 5000; Packaging: Tape and Reel; Case/Package: 0603; Height: 0.022inch; Construction: Rectangular; Min Operating Temperature: -55°C; Termination: SMD/SMT; Features: Moisture Resistant; Number of Terminations: 2; Case Code (Metric): 1608; Technology: THIN FILM; Military Standard: Not; Length: 0.063inch; Voltage Rating (DC): 75V; Temperature Coefficient: 25ppm/°C; Weight: 7.1E-05oz; Width: 0.8mm; Series: RT; Resistor Type: Thin Film
RT63-RT70 = NTCLE350E4103FHB0: Thermistor; Manufacturer_Name: Vishay; Datasheet Link: https://www.vishay.com/docs/29218/ntcle350e4.pdf; Height: 7mm; Manufacturer_Part_Number: NTCLE350E4103FHB0
U1 = CMP-015-00012-1: 5-V, 8: 1, 1-channel general-purpose analog multiplexer with 1.8-V input logic 16-TSSOP -40 to 125; RoHS Compliant: Yes
U2 = CMP-014-00010-1: MCP6N11 Series Single Channel 500 KHz 5.5 V Instrumentation Amplifier - SOIC-8; Bandwidth: 500kHz; Min Supply Voltage: 1.8V; Number of Elements: 2; Gain Bandwidth Product: 35MHz; Input Offset Voltage (Vos): 350uV; Number of Channels: 1; Nominal Supply Current: 800uA; Common Mode Rejection Ratio: 86dB; Slew Rate: 6V/µs; Max Supply Voltage: 5.5V; Slew Rate-Nom: 9V/µs; Input Bias Current: 10pA; Mounting Technology: Surface Mount; Package Quantity: 100; Pins: 8; Width: 3.9mm; Length: 4.9mm; Case/Package: SOIC; Min Operating Temperature: -40°C; Radiation Hardening: No; RoHS Compliant: Yes; Unity Gain Bandwidth Product: 35MHz; Lead Free: Lead Free; Number of Amplifiers: 1; Max Operating Temperature: 125°C; Height: 1.25mm; Packaging: Rail/Tube; Input Offset Voltage-Max: 350uV; Reach SVHC Compliant: Yes; Supply Current: 800uA; Max Supply Current: 800uA; Power Supply Rejection Ratio (PSRR): 86dB; Number of Circuits: 1

## Nets that join several sheets
GND: Processing interface (42 pins), Thermistors (62 pins), Power Supply Unit (18 pins), Weatstone bridge (13 pins)
NetC1_1: Processing interface (27 pins), Power Supply Unit (9 pins), Weatstone bridge (R3.2 U1.2 U1.13)
NetC7_1: Processing interface (16 pins), Power Supply Unit (IC1.7 IC1.8)
NetC8_2: Processing interface (16 pins), Power Supply Unit (PS1.7 PS1.8), Weatstone bridge (R5.1 R7.1)
NetIC2_3: Processing interface (8 pins), Weatstone bridge (U2.6)